# Altium schematic sheet sheet1.SchDoc
size A3
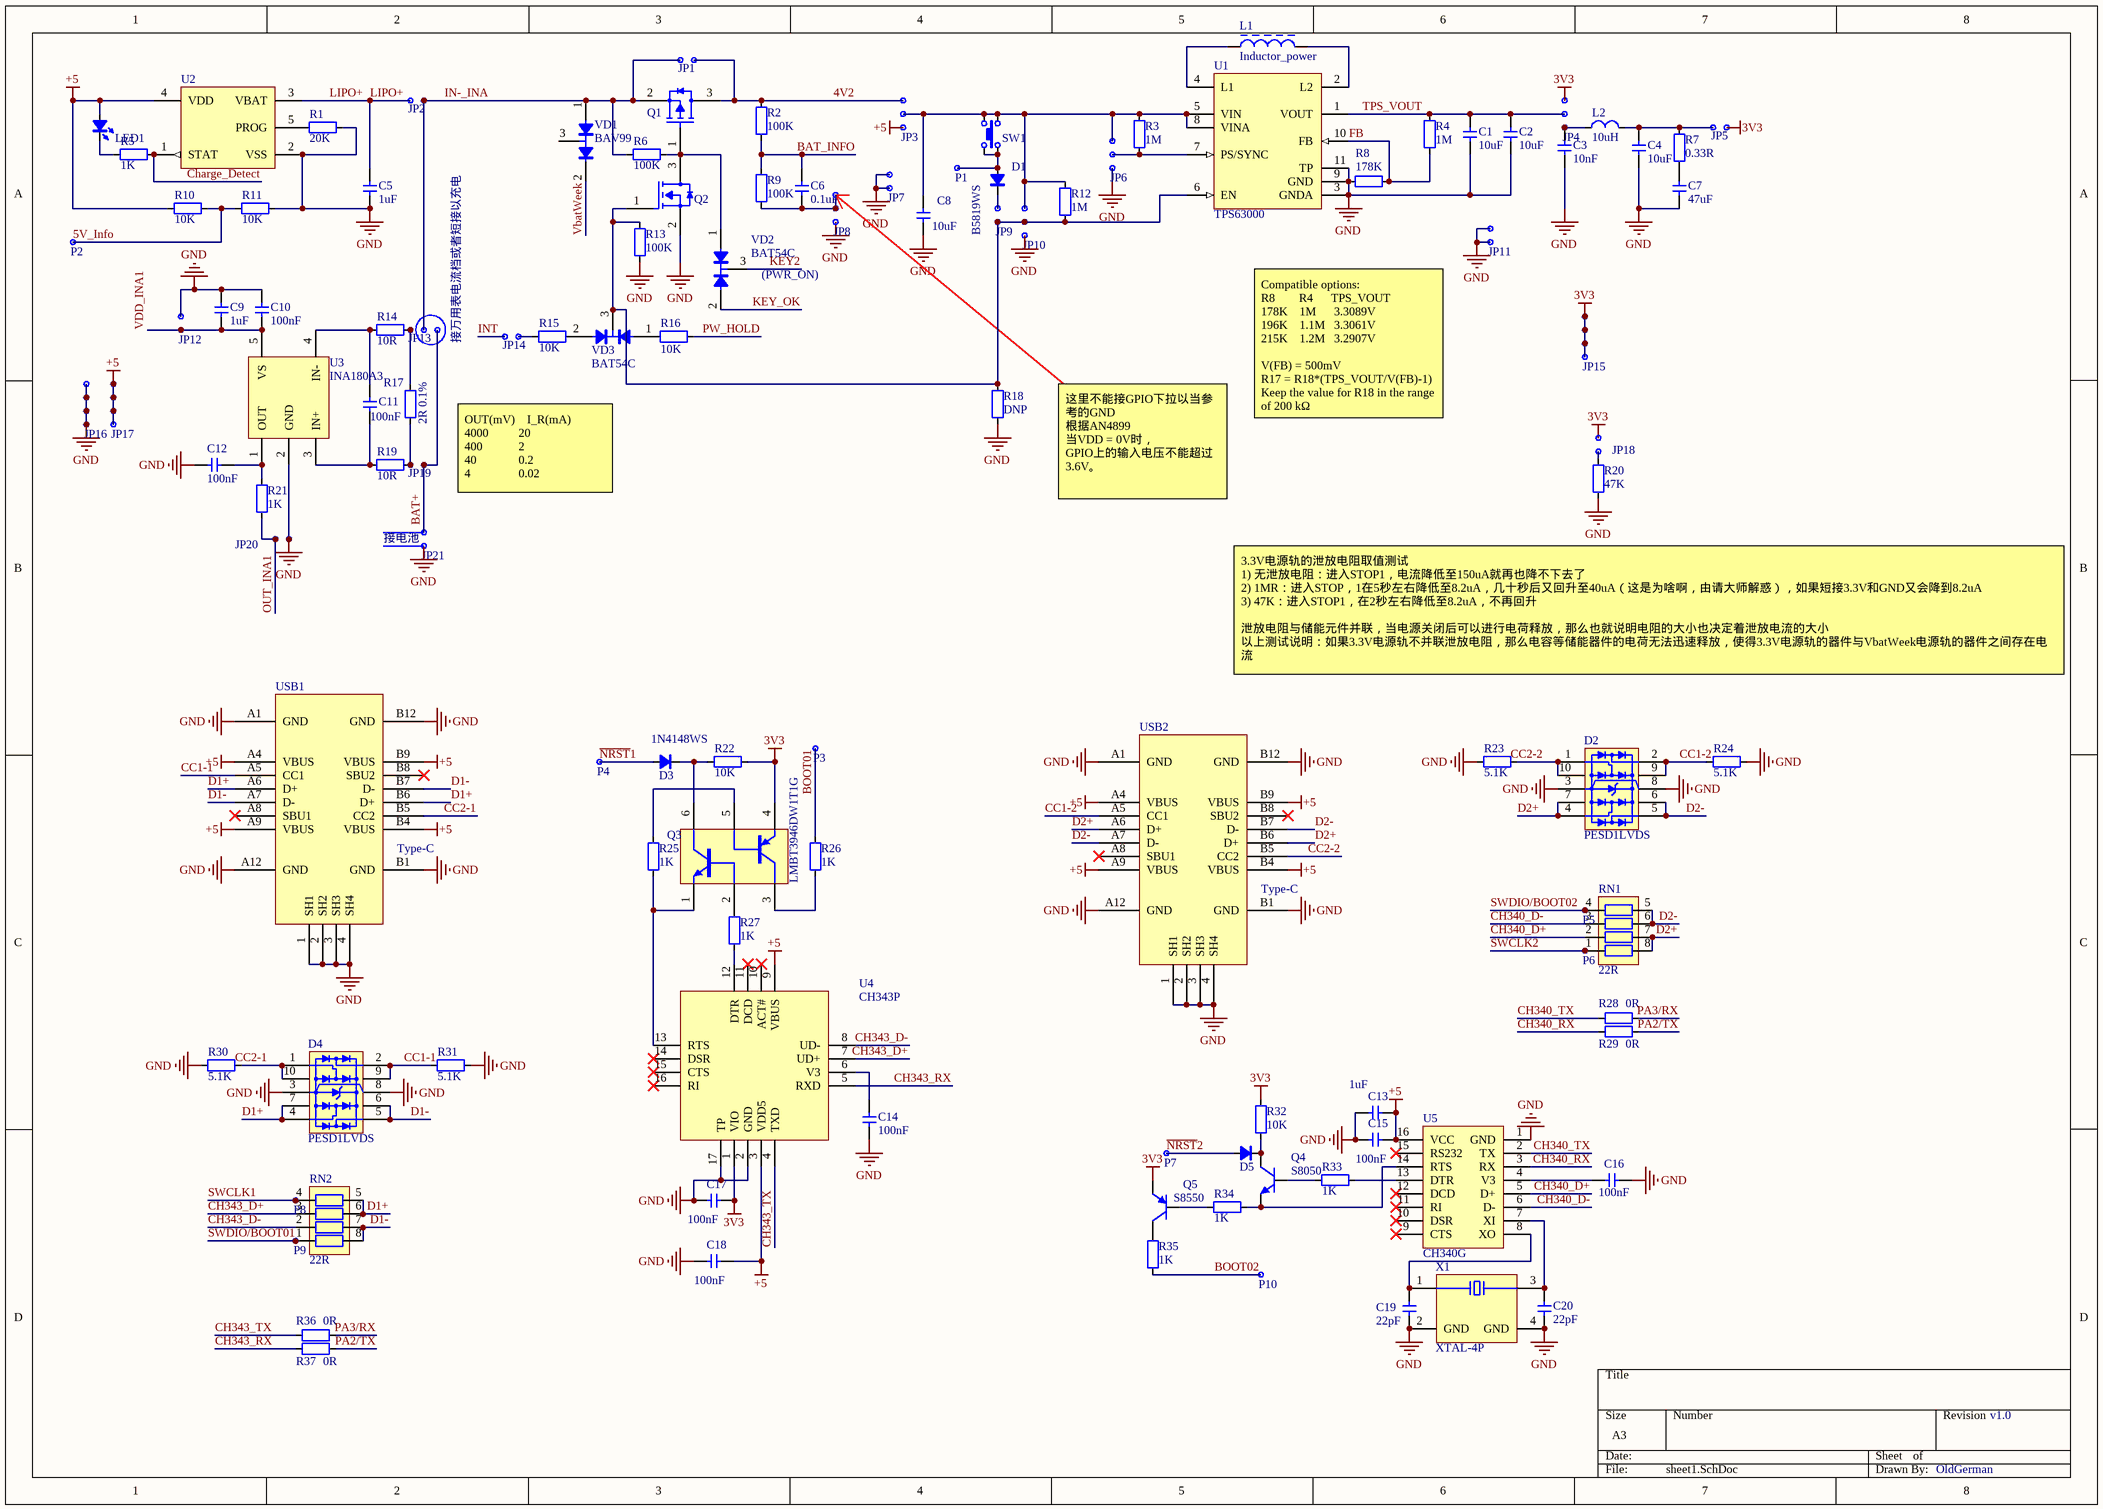
[diagram p0: sheet1.SchDoc]

## Parts
C1  10uF  [C0603]
C2  10uF  [C0603]
C3  10nF  [C0603]
C4  10uF  [C0603]
C5  1uF  [C0603]
C6  0.1uF  [C0603]
C7  47uF  [C1206]
C8  10uF  [C0603]
C9  1uF  [C0603]
C10  100nF  [C0603]
C11  100nF  [C0603]
C12  100nF  [C0603]
C13  1uF  [C0603]
C14  100nF  [C0603]
C15  100nF  [C0603]
C16  100nF  [C0603]
C17  100nF  [C0603]
C18  100nF  [C0603]
C19  22pF  [C0603]
C20  22pF  [C0603]
D1  B5819WS  [SOD-323]
D2  PESD1LVDS  [DFN2510-10_SOT1165-1]
D3  1N4148WS  [SOD-323]
D4  PESD1LVDS  [DFN2510-10_SOT1165-1]
D5  DIODE  [SOD-323]  (value not drawn)
JP1  CONN_X2_DOT  [2.54mm_Male_x2]  (value not drawn)
JP2  CONN_X2_DOT  [2.54mm_Male_x2]  (value not drawn)
JP3  CONN_X3_DOT  [2.54mm_Male_x3]  (value not drawn)
JP4  CONN_X3_DOT  [2.54mm_Male_x3]  (value not drawn)
JP5  CONN_X2_DOT  [2.54mm_Male_x2]  (value not drawn)
JP6  CONN_X3_DOT  [2.54mm_Male_x3]  (value not drawn)
JP7  CONN_X2_DOT  [2.54mm_Male_x2]  (value not drawn)
JP8  CONN_X3_DOT  [2.54mm_Male_x3]  (value not drawn)
JP9  CONN_X2_DOT  [2.54mm_Male_x2]  (value not drawn)
JP10  CONN_X3_DOT  [2.54mm_Male_x3]  (value not drawn)
JP11  CONN_X2_DOT  [2.54mm_Male_x2]  (value not drawn)
JP12  CONN_X2_DOT  [2.54mm_Male_x2]  (value not drawn)
JP13  CONN_X3_DOT  [2.54mm_Male_x3]  (value not drawn)
JP14  CONN_X2_DOT  [2.54mm_Male_x2]  (value not drawn)
JP15  CONN_X4_DOT  [2.54mm_Male_x4]  (value not drawn)
JP16  CONN_X4_DOT  [2.54mm_Male_x4]  (value not drawn)
JP17  CONN_X4_DOT  [2.54mm_Male_x4]  (value not drawn)
JP18  CONN_X2_DOT  [2.54mm_Male_x2]  (value not drawn)
JP19  CONN_X2_DOT  [2.54mm_Male_x2]  (value not drawn)
JP20  CONN_X2_DOT  [2.54mm_Male_x2]  (value not drawn)
JP21  CONN_X2_DOT  [2.54mm_Male_x2]  (value not drawn)
L1  Inductor_power  [TDK VLS252012CX]
L2  10uH  [FER0805]
LED1  LED  [LED0603_WHITE]  (value not drawn)
P1  CONN_X1_DOT  [2.54mm_Male_x1]  (value not drawn)
P2  CONN_X1_DOT  [2.54mm_Male_x1]  (value not drawn)
P3  CONN_X1_DOT  [2.54mm_Male_x1]  (value not drawn)
P4  CONN_X1_DOT  [2.54mm_Male_x1]  (value not drawn)
P5  CONN_X1_DOT  [2.54mm_Male_x1]  (value not drawn)
P6  CONN_X1_DOT  [2.54mm_Male_x1]  (value not drawn)
P7  CONN_X1_DOT  [2.54mm_Male_x1]  (value not drawn)
P8  CONN_X1_DOT  [2.54mm_Male_x1]  (value not drawn)
P9  CONN_X1_DOT  [2.54mm_Male_x1]  (value not drawn)
P10  CONN_X1_DOT  [2.54mm_Male_x1]  (value not drawn)
Q1  P-MOS  [INFINEON SOT-23-3]  (value not drawn)
Q2  N-MOS  [INFINEON SOT-23-3]  (value not drawn)
Q3  LMBT3946DW1T1G  [ON SEMI SOT-363]
Q4  S8050  [INFINEON SOT-23-3]
Q5  S8550  [INFINEON SOT-23-3]
R1  20K  [R0603]
R2  100K  [R0603]
R3  1M  [R0603]
R4  1M  [R0603]
R5  1K  [R0603]
R6  100K  [R0603]
R7  0.33R  [R0603]
R8  178K  [R0603]
R9  100K  [R0603]
R10  10K  [R0603]
R11  10K  [R0603]
R12  1M  [R0603]
R13  100K  [R0603]
R14  10R  [R0603]
R15  10K  [R0603]
R16  10K  [R0603]
R17  2R 0.1%  [R0805]
R18  DNP  [R0603]
R19  10R  [R0603]
R20  47K  [R0603]
R21  1K  [R0603]
R22  10K  [R0603]
R23  5.1K  [R0603]
R24  5.1K  [R0603]
R25  1K  [R0603]
R26  1K  [R0603]
R27  1K  [R0603]
R28  0R  [R0603]
R29  0R  [R0603]
R30  5.1K  [R0603]
R31  5.1K  [R0603]
R32  10K  [R0603]
R33  1K  [R0603]
R34  1K  [R0603]
R35  1K  [R0603]
R36  0R  [R0603]
R37  0R  [R0603]
RN1  22R  [RESNET 1206-8 CONCAVE]
RN2  22R  [RESNET 1206-8 CONCAVE]
SW1  Button-4P  [SWITCH_3X4X2.5_4PIN_SMD]  (value not drawn)
U1  TPS63000  [TI PVSON-10 3x3MM DRC]
U2  MCP73831T  [MICROCHIP SOT-23-5 OT]  (value not drawn)
U3  INA180A3  [TI SOT-23-5 DBV]
U4  CH343P  [Analog QFN-16 3x3MM]
U5  CH340G  [TI SOP-16 D]
USB1  Type-C  [Type-C-TOP]
USB2  Type-C  [Type-C-TOP]
VD1  BAV99  [INFINEON SOT-23-3]
VD2  BAT54C  [INFINEON SOT-23-3]
VD3  BAT54C  [INFINEON SOT-23-3]
X1  XTAL-4P  [EPSON TSX-3225]

## Nets
3V3: C17.2 JP4.1 JP5.2 JP15.1 JP15.2 JP15.3 JP15.4 JP18.1 Q3.4(E) Q5.2(E) R22.1 R32.1 U4.1(VIO)
+5: C13.2 C15.2 C18.2 JP3.3 JP17.1 JP17.2 JP17.3 JP17.4 LED1.1(A) R10.2 U2.4(VDD) U4.3(VDD5) U4.9(VBUS) U5.16(VCC) USB1.A4(VBUS) USB1.A9(VBUS) USB1.B4(VBUS) USB1.B9(VBUS) USB2.A4(VBUS) USB2.A9(VBUS) USB2.B4(VBUS) USB2.B9(VBUS)
GND: C1.2 C2.2 C3.1 C4.2 C5.2 C7.2 C8.2 C9.2 C10.2 C12.2 C13.1 C14.2 C15.1 C16.2 C17.1 C18.1 C19.1 C20.1 D2.3(GND) D2.8(GND) D4.3(GND) D4.8(GND) JP6.3 JP7.1 JP7.2 JP8.3 JP10.3 JP11.1 JP11.2 JP12.1 JP16.1 JP16.2 JP16.3 JP16.4 JP20.2 JP21.2 Q2.2(S) R1.1 R8.2 R11.1 R13.1 R18.1 R20.1 R23.2 R24.1 R30.2 R31.1 U1.3(GNDA) U1.9(GND) U1.11(TP) U2.2(VSS) U3.2(GND) U4.2(GND) U4.17(TP) U5.1(GND) USB1.1(SH1) USB1.2(SH2) USB1.3(SH3) USB1.4(SH4) USB1.A1(GND) USB1.A12(GND) USB1.B1(GND) USB1.B12(GND) USB2.1(SH1) USB2.2(SH2) USB2.3(SH3) USB2.4(SH4) USB2.A1(GND) USB2.A12(GND) USB2.B1(GND) USB2.B12(GND) X1.2(GND) X1.4(GND)
4V2: JP1.2 JP3.1 Q1.3(D) R2.2
5V_Info: P2.1 R10.1 R11.2
BAT+: JP13.3 JP19.2 JP21.1
BAT_INFO: C6.1 R2.1 R9.2
BOOT01: P3.1 R26.1
BOOT02: P10.1 R35.2
CC1-1: D4.2(I/O) D4.9(GND) R31.2 USB1.A5(CC1)
CC1-2: D2.2(I/O) D2.9(GND) R24.2 USB2.A5(CC1)
CC2-1: D4.1(I/O) D4.10(GND) R30.1 USB1.B5(CC2)
CC2-2: D2.1(I/O) D2.10(GND) R23.1 USB2.B5(CC2)
CH340_D+: RN1.2 U5.5(D+)
CH340_D-: RN1.3 U5.6(D-)
CH340_RX: R29.1 U5.3(RX)
CH340_TX: R28.1 U5.2(TX)
CH343_D+: RN2.3 U4.7(UD+)
CH343_D-: RN2.2 U4.8(UD-)
CH343_RX: R37.1 U4.5(RXD)
CH343_TX: R36.1 U4.4(TXD)
Charge_Detect: R5.1 U2.1(STAT)
D1+: D4.4(I/O) D4.7(GND) RN2.5 RN2.6 USB1.A6(D+) USB1.B6(D+)
D1-: D4.5(I/O) D4.6(GND) RN2.7 RN2.8 USB1.A7(D-) USB1.B7(D-)
D2+: D2.4(I/O) D2.7(GND) RN1.7 RN1.8 USB2.A6(D+) USB2.B6(D+)
D2-: D2.5(I/O) D2.6(GND) RN1.5 RN1.6 USB2.A7(D-) USB2.B7(D-)
FB: R4.1 R8.1 U1.10(FB)
IN-_INA: JP1.1 JP2.2 JP13.2 Q1.2(S) R6.2 VD1.1
INT: JP14.1
KEY2: VD2.3
KEY_OK: VD2.2
LIPO+: C5.1 JP2.1 U2.3(VBAT)
~{NRST}1: D3.1(A) P4.1
~{NRST}2: D5.1(A) P7.1
OUT_INA1: JP20.1 R21.1
PA2/TX: R29.2 R37.2
PA3/RX: R28.2 R36.2
PW_HOLD: R16.1
SWCLK1: P8.1 RN2.4
SWCLK2: P6.1 RN1.1
SWDIO/BOOT01: P9.1 RN2.1
SWDIO/BOOT02: P5.1 RN1.4
TPS_VOUT: C1.1 C2.1 JP4.2 R4.2 U1.1(VOUT)
VbatWeek: VD1.2
VDD_INA1: C9.1 C10.1 JP12.2 U3.5(VS)
NetC3_2: C3.2 JP4.3 L2.1
NetC4_1: C4.1 JP5.1 L2.2 R7.2
NetC6_2: C6.2 JP8.1 JP8.2 R9.1
NetC7_1: C7.1 R7.1
NetC8_1: C8.1 JP3.2 JP6.1 JP10.1 R3.1 R12.1 SW1.3 SW1.4 U1.5(VIN) U1.8(VINA)
NetC11_1: C11.1 R19.1 U3.3(IN+)
NetC11_2: C11.2 R14.1 U3.4(IN-)
NetC12_1: C12.1 R21.2 U3.1(OUT)
NetC14_1: C14.1 U4.6(V3)
NetC16_1: C16.1 U5.4(V3)
NetC19_2: C19.2 U5.8(XO) X1.1
NetC20_2: C20.2 U5.7(XI) X1.3
NetD1_1: D1.1(A) P1.1 SW1.1 SW1.2
NetD1_2: D1.2(C) JP9.1
NetD3_2: D3.2(C) Q3.6(C) R22.2
NetD5_2: D5.2(C) Q4.3(C) R32.2
NetJP6_2: JP6.2 R3.2 U1.7(PS/SYNC)
NetJP9_2: JP9.2 JP10.2 Q2.1(G) R12.2 R13.2 R18.2 U1.6(EN) VD3.3
NetJP13_1: JP13.1 R14.2 R17.1
NetJP14_2: JP14.2 R15.1
NetJP18_2: JP18.2 R20.2
NetJP19_1: JP19.1 R17.2 R19.2
NetL1_1: L1.1 U1.4(L1)
NetL1_2: L1.2 U1.2(L2)
NetLED1_2: LED1.2(K) R5.2
NetQ1_1: Q1.1(G) Q2.3(D) R6.1 VD2.1
NetQ3_1: Q3.1(E) R25.2 U4.13(RTS)
NetQ3_2: Q3.2(B) R27.2
NetQ3_3: Q3.3(C) R26.2
NetQ3_5: Q3.5(B) R25.1
NetQ4_1: Q4.1(B) R33.1
NetQ4_2: Q4.2(E) R34.2 U5.14(RTS)
NetQ5_1: Q5.1(B) R34.1
NetQ5_3: Q5.3(C) R35.1
NetR1_2: R1.2 U2.5(PROG)
NetR15_2: R15.2 VD3.2
NetR16_2: R16.2 VD3.1
NetR27_1: R27.1 U4.12(DTR)
NetR33_2: R33.2 U5.13(DTR)

Not connected (* = marked no-connect by the designer): U4 10(ACT#)* 11(DCD)* 14(DSR)* 15(CTS)* 16(RI)*; U5 9(CTS)* 10(DSR)* 11(RI)* 12(DCD)* 15(RS232)*; USB1 A8(SBU1)* B8(SBU2)*; USB2 A8(SBU1)* B8(SBU2)*; VD1 3

## Notes on the sheet
- (PWR_ON)
- (near JP13) 接万用表电流档或者短接以充电
- Compatible options:
  R8        R4      TPS_VOUT
  178K    1M      3.3089V
  196K    1.1M   3.3061V
  215K    1.2M   3.2907V
  V(FB) = 500mV
  R17 = R18*(TPS_VOUT/V(FB)-1)
  Keep the value for R18 in the range of 200 kΩ
- OUT(mV)    I_R(mA)
  4000          20
  400            2
  40              0.2
  4                0.02
- 这里不能接GPIO下拉以当参考的GND
  根据AN4899
  当VDD = 0V时，
  GPIO上的输入电压不能超过3.6V。
- (near JP21) 接电池
- 3.3V电源轨的泄放电阻取值测试
  1) 无泄放电阻：进入STOP1，电流降低至150uA就再也降不下去了
  2) 1MR：进入STOP，1在5秒左右降低至8.2uA，几十秒后又回升至40uA（这是为啥啊，由请大师解惑），如果短接3.3V和GND又会降到8.2uA
  3) 47K：进入STOP1，在2秒左右降低至8.2uA，不再回升
  泄放电阻与储能元件并联，当电源关闭后可以进行电荷释放，那么也就说明电阻的大小也决定着泄放电流的大小
  以上测试说明：如果3.3V电源轨不并联泄放电阻，那么电容等储能器件的电荷无法迅速释放，使得3.3V电源轨的器件与VbatWeek电源轨的器件之间存在电流
- v1.0
- OldGerman

## Library data of the parts
C1-C20 = CAP: Capacitor; Value: 0.1u
D1 = DIODE: 肖特基二极管
D2 D4 = PESD1LVDS: Ultra-Low Capacitance TVS Protection; BOM名称: 钳位IC; 版权归属: 源创客; 属性: 30V/0.2A; 学习资源: www.ooocke.com
D3 D5 = DIODE: 二极管
L1 = Inductor_power: 功率电感
L2 = inductor_mini: 贴片叠层电感
LED1 = LED: Value: color?
Q1 = P-MOS_123
Q2 = N-MOS_123
Q3 = LMBT3946DW1T1G: PNP+NPN, SOT-363; ComponentLink1Description: Datasheet; ComponentLink1URL: https://fscdn.rohm.com/en/products/databook/datasheet/discrete/transistor/digital/umh3ntn-e.pdf
Q4 = S8050: NPN型; BOM名称: 高频放大-NPN型; 版权归属: 源创客; 属性: 40V 1.5A 1W 100MHZ; 学习资源: www.ooocke.com
Q5 = S8550: PNP型; BOM名称: 高频放大-NPN型; 版权归属: 源创客; 属性: 40V 1.5A 1W 100MHZ; 学习资源: www.ooocke.com
R1-R37 = RES: Resistor; Value: 22R
RN1 RN2 = RES-8P4R: 贴片网络排阻; 版权归属: 源创客; BOM名称: 贴片网络排阻; 学习资源: www.ooocke.com
SW1 = Button-4P: Button
U1 = TPS63000: Buck-Boost Converter / 具有 1.8A 电流开关并采用 3x3 QFN 封装的高效率降压/升压转换器; ComponentLink1Description: TPS63000; ComponentLink1URL: https://www.ti.com.cn/cn/lit/gpn/tps63000
U3 = INA180Ax: Low- and High-Side Voltage Output, Current-Sense Amplifiers
U4 = CH343P: usb to ttl
U5 = CH340G: 丐中丐，需要外接12M晶振
USB1 USB2 = USB-Type-C_16P
VD1 = BAV99: Dual Series Switching Diodes; BOM名称: 肖特基二极管; 版权归属: 源创客; 属性: 30V/0.2A; 学习资源: www.ooocke.com; ComponentLink1Description: Datasheet; ComponentLink1URL: https://www.onsemi.com/pub/Collateral/BAV99WT1-D.PDF
VD2 VD3 = BAT54C: 贴片肖特基二极管; BOM名称: 肖特基二极管; 版权归属: 源创客; 属性: 30V/0.2A; 学习资源: www.ooocke.com
X1 = XTAL-4P: 4脚无源石英晶振; BOM名称: 4脚无源晶振; 版权归属: 源创客; 学习资源: www.ooocke.com